# Altium schematic sheet [5]-PEAKMETER_LEDS.SchDoc
size A3; SheetNumber: 6; SheetTotal: 8
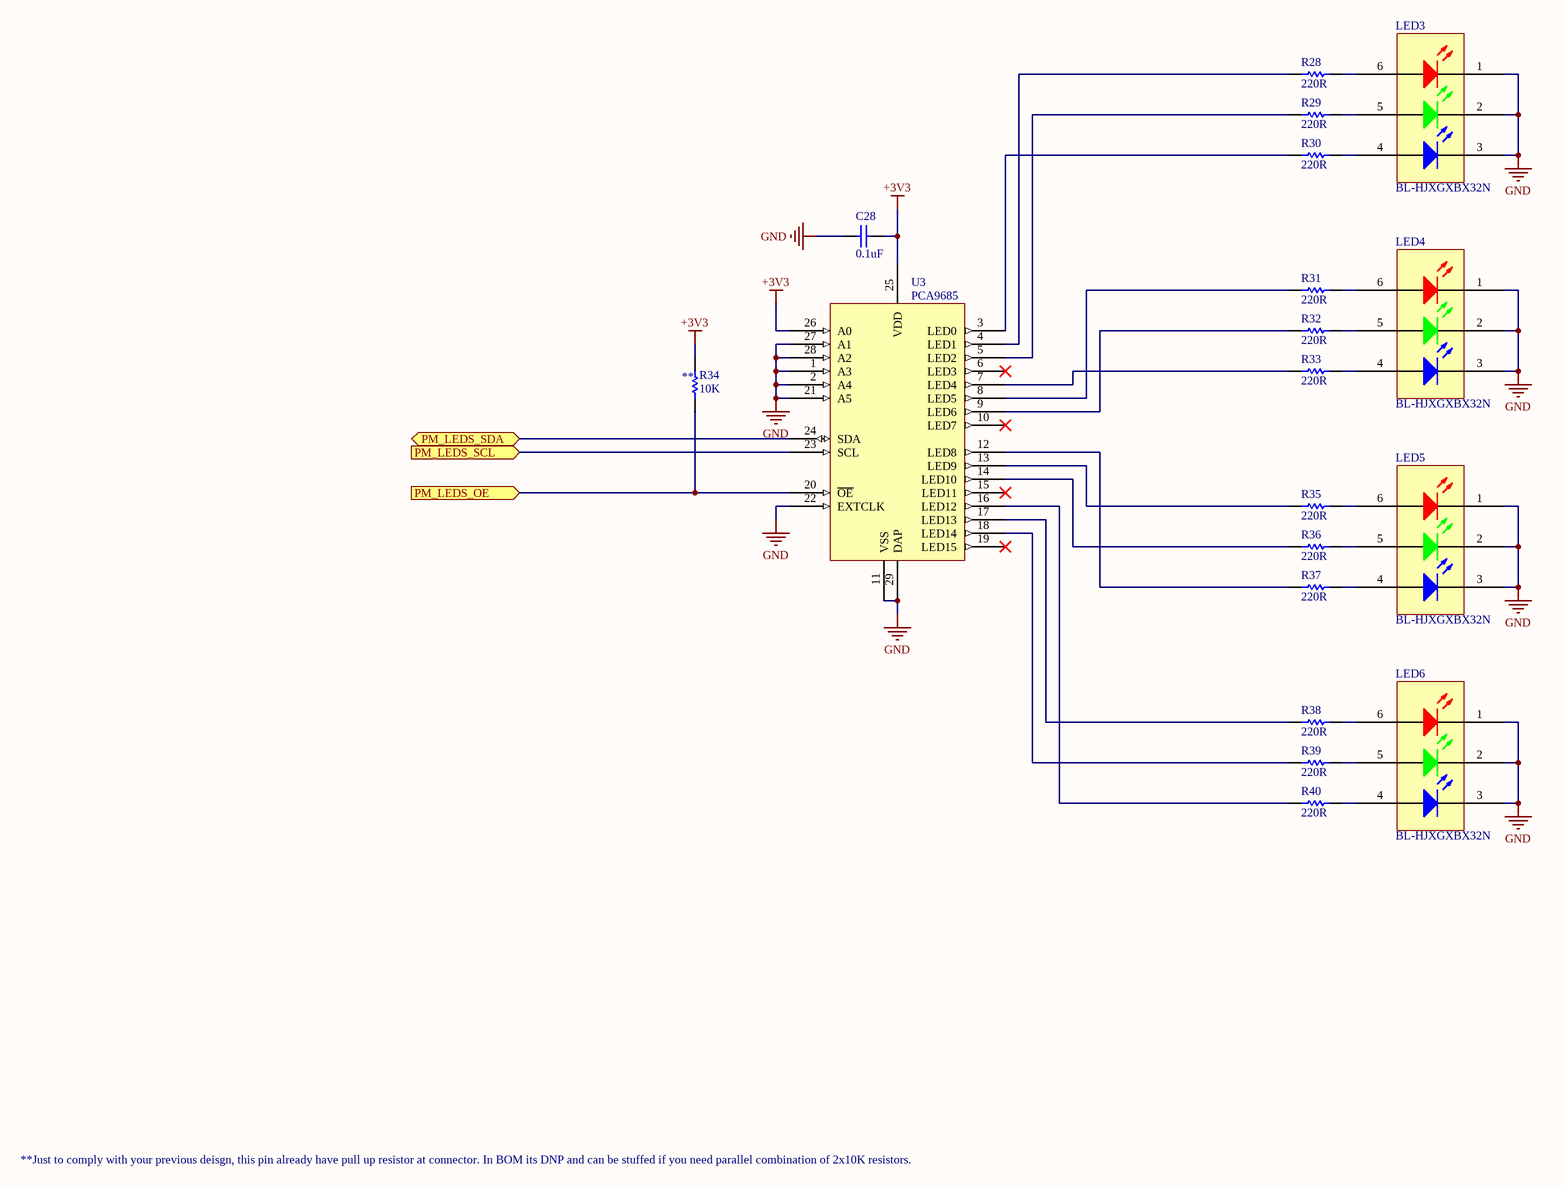
[diagram p0: [5]-PEAKMETER_LEDS.SchDoc]

## Parts
C28  0.1uF  [CAPC1608N]
LED3  BL-HJXGXBX32N  [BL-HJXGXBX32N]
LED4  BL-HJXGXBX32N  [BL-HJXGXBX32N]
LED5  BL-HJXGXBX32N  [BL-HJXGXBX32N]
LED6  BL-HJXGXBX32N  [BL-HJXGXBX32N]
R28  220R  [RESC1608N]
R29  220R  [RESC1608N]
R30  220R  [RESC1608N]
R31  220R  [RESC1608N]
R32  220R  [RESC1608N]
R33  220R  [RESC1608N]
R34  10K  [RESC1608N]
R35  220R  [RESC1608N]
R36  220R  [RESC1608N]
R37  220R  [RESC1608N]
R38  220R  [RESC1608N]
R39  220R  [RESC1608N]
R40  220R  [RESC1608N]
U3  PCA9685  [SOT788-1]

## Ports
PM_LEDS_OE (in), PM_LEDS_SCL (in), PM_LEDS_SDA (bidir)

## Nets
+3V3: C28.1 R34.1 U3.25(VDD) U3.26(A0)
GND: C28.2 LED3.1 LED3.2 LED3.3 LED4.1 LED4.2 LED4.3 LED5.1 LED5.2 LED5.3 LED6.1 LED6.2 LED6.3 U3.1(A3) U3.2(A4) U3.11(VSS) U3.21(A5) U3.22(EXTCLK) U3.27(A1) U3.28(A2) U3.29(DAP)
PM_LEDS_OE: R34.2 U3.20(~{OE}) ; port PM_LEDS_OE
PM_LEDS_SCL: U3.23(SCL) ; port PM_LEDS_SCL
PM_LEDS_SDA: U3.24(SDA) ; port PM_LEDS_SDA
NetLED3_4: LED3.4 R30.2
NetLED3_5: LED3.5 R29.2
NetLED3_6: LED3.6 R28.2
NetLED4_4: LED4.4 R33.2
NetLED4_5: LED4.5 R32.2
NetLED4_6: LED4.6 R31.2
NetLED5_4: LED5.4 R37.2
NetLED5_5: LED5.5 R36.2
NetLED5_6: LED5.6 R35.2
NetLED6_4: LED6.4 R40.2
NetLED6_5: LED6.5 R39.2
NetLED6_6: LED6.6 R38.2
NetR28_1: R28.1 U3.4(LED1)
NetR29_1: R29.1 U3.5(LED2)
NetR30_1: R30.1 U3.3(LED0)
NetR31_1: R31.1 U3.8(LED5)
NetR32_1: R32.1 U3.9(LED6)
NetR33_1: R33.1 U3.7(LED4)
NetR35_1: R35.1 U3.13(LED9)
NetR36_1: R36.1 U3.14(LED10)
NetR37_1: R37.1 U3.12(LED8)
NetR38_1: R38.1 U3.17(LED13)
NetR39_1: R39.1 U3.18(LED14)
NetR40_1: R40.1 U3.16(LED12)

Not connected (* = marked no-connect by the designer): U3 6(LED3)* 10(LED7)* 15(LED11)* 19(LED15)*

## Notes on the sheet
- (near R34) **
- **Just to comply with your previous deisgn, this pin already have pull up resistor at connector. In BOM its DNP and can be stuffed if you need parallel combination of 2x10K resistors.

## Library data of the parts
C28 = CC0603KRX7R8BB104: CAP CER 0.1UF 25V X7R 0603; Manufacturer 1: Yageo; Capacitance: 100nF; Tolerance: 10%; Supplier 1: Digi-Key; Manufacturer Part Number 1: CC0603KRX7R8BB104; Stock 1: 40000; Pricing 1: 1=0.1, 10=0.074, 100=0.0329, 500=0.02352, 1000=0.01848 (USD); Mount: Surface Mount; Case/Package: 0603; Number of Pins: 2; Case Code (Imperial): 0603; Case Code (Metric): 1608; Min Operating Temperature: -55°C; Max Operating Temperature: 125°C; Dielectric: X7R; Voltage Rating: 25V; Packaging: Tape and Reel; Package Quantity: 1; Voltage Rating (DC): 25V; Termination: SMD/SMT; Composition: Ceramic; Voltage: 25V; Length: 1.6mm; Height: 0.8mm; Width: 0.8mm; Thickness: 0.035inch; Depth: 0.8mm; Radiation Hardening: No; REACH SVHC: Unknown; Lead Free: Lead Free; Halogen Free: Halogen Free; ComponentLink1URL: https://datasheet.ciiva.com/11786/0900766b80c10176-11786120.pdf; ComponentLink1Description: https://datasheet.ciiva.com/11786/0900766b80c10176-11786120.pdf; ComponentLink2URL: https://datasheet.ciiva.com/144/mlccorderingcode-144075.pdf; ComponentLink2Description: https://datasheet.ciiva.com/144/mlccorderingcode-144075.pdf; ComponentLink3URL: https://datasheet.ciiva.com/17434/upy-gphc-x7r-6-3v-to-50v-8-17434263.pdf; ComponentLink3Description: https://datasheet.ciiva.com/17434/upy-gphc-x7r-6-3v-to-50v-8-17434263.pdf; ComponentLink4URL: https://datasheet.ciiva.com/26829/getdatasheetpartid-403577-26829431.pdf; ComponentLink4Description: https://datasheet.ciiva.com/26829/getdatasheetpartid-403577-26829431.pdf; ComponentLink5URL: https://datasheet.ciiva.com/11587/upy-gphc-x7r-6-3v-to-50v-8-11587208.pdf; ComponentLink5Description: https://datasheet.ciiva.com/11587/upy-gphc-x7r-6-3v-to-50v-8-11587208.pdf; ComponentLink6URL: https://datasheet.ciiva.com/13389/upy-gphc-x7r-6-3v-to-50v-8-13389352.pdf; ComponentLink6Description: https://datasheet.ciiva.com/13389/upy-gphc-x7r-6-3v-to-50v-8-13389352.pdf; ComponentLink7URL: https://datasheet.ciiva.com/28450/1489800-28450584.pdf; ComponentLink7Description: https://datasheet.ciiva.com/28450/1489800-28450584.pdf; ComponentLink8URL: https://datasheet.ciiva.com/144/mlccorderingcode-144073.pdf; ComponentLink8Description: https://datasheet.ciiva.com/144/mlccorderingcode-144073.pdf; ComponentLink9URL: https://datasheet.ciiva.com/144/mlccorderingcode-144074.pdf; ComponentLink9Description: https://datasheet.ciiva.com/144/mlccorderingcode-144074.pdf; ComponentLink10URL: https://datasheet.ciiva.com/7978/1489800-7978155.pdf; ComponentLink10Description: https://datasheet.ciiva.com/7978/1489800-7978155.pdf; Supplier Part Number 1: 311-1341-1-ND
LED3-LED6 = BL-HJXGXBX32N: LED RGB 6PLCC SMD; Manufacturer 1: American Bright; Supplier 1: Digi-Key; Manufacturer Part Number 1: BL-HJXGXBX32N; Stock 1: 23855; Pricing 1: 1=0.59000, 10=0.42700, 100=0.27880, 500=0.20040, 1000=0.15683 (USD); RoHS: No; Packaging: Cut Tape; Supplier Part Number 1: BL-HJXGXBX32NCT-ND
R28-R33 R35-R40 = CRCW0603220RJNEA: RES SMD 220 OHM 5% 1/10W 0603; Manufacturer 1: Vishay; Power Rating: 100mW; Temperature Coefficient: 200ppm/°C; Voltage Rating: 75V; Supplier 1: Digi-Key; Manufacturer Part Number 1: CRCW0603220RJNEA; Stock 1: 284000; Pricing 1: 1=0.1, 10=0.031, 100=0.0125, 1000=0.00563, 2500=0.00488 (USD); Mount: Surface Mount; Case/Package: 0603; Weight: 7.1E-05oz; Case Code (Metric): 1608; Case Code (Imperial): 0603; Contact Plating: Tin; Min Operating Temperature: -55°C; Max Operating Temperature: 155°C; Resistance: 220R; Tolerance: 5%; Packaging: Tape and Reel; Composition: Thick Film; Package Quantity: 1; Number of Terminations: 2; Max Power Dissipation: 100mW; Military Standard: Not; Termination: SMD/SMT; Features: Automotive AEC-Q200; Working Voltage: 75V; Length: 1.55mm; Height: 0.45mm; Width: 0.033inch; Depth: 0.85mm; Radiation Hardening: No; REACH SVHC: Unknown; ComponentLink1URL: https://datasheet.ciiva.com/2524/dcrcwe3-2524384.pdf; ComponentLink1Description: https://datasheet.ciiva.com/2524/dcrcwe3-2524384.pdf; ComponentLink2URL: https://datasheet.ciiva.com/2524/dcrcwe3-2524385.pdf; ComponentLink2Description: https://datasheet.ciiva.com/2524/dcrcwe3-2524385.pdf; ComponentLink3URL: https://datasheet.ciiva.com/2524/dcrcwe3-2524386.pdf; ComponentLink3Description: https://datasheet.ciiva.com/2524/dcrcwe3-2524386.pdf; ComponentLink4URL: https://datasheet.ciiva.com/8339/dcrcwe3-8339958.pdf; ComponentLink4Description: https://datasheet.ciiva.com/8339/dcrcwe3-8339958.pdf; ComponentLink5URL: https://datasheet.ciiva.com/22869/70201119-22869142.pdf; ComponentLink5Description: https://datasheet.ciiva.com/22869/70201119-22869142.pdf; ComponentLink6URL: https://datasheet.ciiva.com/46448/1807946-46448601.pdf; ComponentLink6Description: https://datasheet.ciiva.com/46448/1807946-46448601.pdf; ComponentLink7URL: https://datasheet.ciiva.com/5550/dcrcwe3-109170-5550730.pdf; ComponentLink7Description: https://datasheet.ciiva.com/5550/dcrcwe3-109170-5550730.pdf; Supplier Part Number 1: 541-220GCT-ND
R34 = AC0603JR-0710KL: RES SMD 10K OHM 5% 1/10W 0603; Manufacturer 1: Yageo; Voltage Rating: 50V; Resistance: 10kR; Power Rating: 100mW; Temperature Coefficient: 100ppm/°C; Supplier 1: Digi-Key; Manufacturer Part Number 1: AC0603JR-0710KL; Stock 1: 60451; Pricing 1: 1=0.1, 10=0.032, 100=0.0131, 1000=0.00588, 2500=0.0051 (USD); Case/Package: 0603; Case Code (Imperial): 0603; Case Code (Metric): 1608; Min Operating Temperature: -55°C; Max Operating Temperature: 155°C; Packaging: Tape and Reel; Tolerance: 5%; Package Quantity: 1; Composition: Thick Film; Termination: SMD/SMT; Number of Terminations: 2; Military Standard: Not; Max Power Dissipation: 100mW; Features: Moisture Resistant,Automotive AEC-Q200,Anti-Sulfur; Length: 0.063inch; Height: 0.022inch; Width: 0.031inch; Depth: 0.8mm; Lead Free: Lead Free; ComponentLink1URL: https://datasheet.ciiva.com/5562/pyu-ac-51-rohs-l-2-5562553.pdf; ComponentLink1Description: https://datasheet.ciiva.com/5562/pyu-ac-51-rohs-l-2-5562553.pdf; Supplier Part Number 1: 311-10KLECT-ND
U3 = IC_PCA9685BS,118: IC LED DRVR LIN DIM 25MA 28HVQFN; Manufacturer 1: NXP Semiconductors; Number of Outputs: 16; Frequency: 50MHz; Output Voltage: 5.5V; Supplier 1: Digi-Key; Manufacturer Part Number 1: PCA9685BS,118; Stock 1: 4307; Pricing 1: 1=2.46, 10=2.205, 100=1.7727, 500=1.45642, 1000=1.20675 (USD); Mount: Surface Mount; Case/Package: VQFN; Number of Pins: 28; Contact Plating: Gold; Min Operating Temperature: -40°C; Max Operating Temperature: 85°C; Packaging: Tape and Reel; Package Quantity: 1; Radiation Hardening: No; ComponentLink1URL: https://datasheet.ciiva.com/12278/pca9685-62190-12278354.pdf; ComponentLink1Description: https://datasheet.ciiva.com/12278/pca9685-62190-12278354.pdf; ComponentLink2URL: https://datasheet.ciiva.com/8125/pca9685-8125351.pdf; ComponentLink2Description: https://datasheet.ciiva.com/8125/pca9685-8125351.pdf; ComponentLink3URL: https://datasheet.ciiva.com/1945/pca9685-1945099.pdf; ComponentLink3Description: https://datasheet.ciiva.com/1945/pca9685-1945099.pdf; ComponentLink4URL: https://datasheet.ciiva.com/1945/pca9685-1945100.pdf; ComponentLink4Description: https://datasheet.ciiva.com/1945/pca9685-1945100.pdf; ComponentLink5URL: https://datasheet.ciiva.com/1945/pca9685-1945101.pdf; ComponentLink5Description: https://datasheet.ciiva.com/1945/pca9685-1945101.pdf; Supplier Part Number 1: 568-5305-1-ND